# Altium schematic sheet IR_Remote_LEDs.SchDoc
size A; SheetNumber: 1; SheetTotal: 1
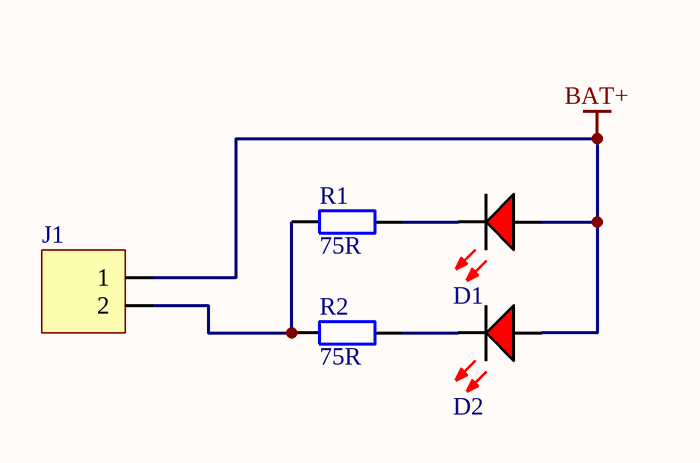
[diagram p0: IR_Remote_LEDs.SchDoc]

## Parts
D1  LED Red  [LED5MM]  (value not drawn)
D2  LED Red  [LED5MM]  (value not drawn)
J1  Connector - JST PH 2-Pin  [JST-P2B-PH]  (value not drawn)
R1  75R  [CR1608-0603_N]
R2  75R  [CR1608-0603_N]

## Nets
BAT+: D1.A D2.A J1.1
NetD1_K: D1.K R1.2
NetD2_K: D2.K R2.2
NetJ1_2: J1.2 R1.1 R2.1

## Library data of the parts
D1 D2 = LED_5MM_RED: LED 5mm Red; Manufacturer: Generic Components; Class I: Optoelectronic; Published: 8-Jun-2000; Revision: July-2002: Re-released for DXP Platform.; Publisher: Altium Limited; Class II: LED; Farnell PN: 1581239; Digikey: *; LCSC: C2286
J1 = JST-B2B-PH-A: LatestRevisionDate: 17-Jul-2002; LatestRevisionNote: Re-released for DXP Platform.; Publisher: Altium Limited; LCSC: *
R1 R2 = Res_CR0603_75R: 100mW SMT ±1% 0603 Chip Resistor; Manufacturer: Generic Components; Class: Passive; Published: 08/06/2000; Publisher: Altium Hobart Technology Centre; SubClass: Resistor; Farnell PN: *; Digikey: *; LCSC: C4275; Value: 75R